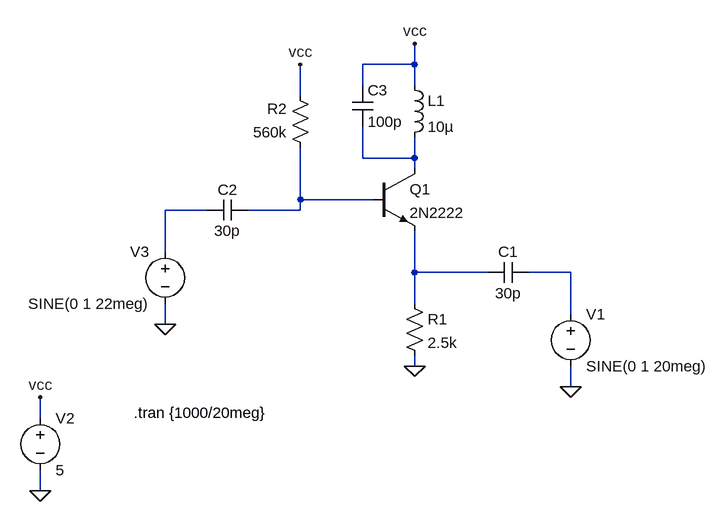
[diagram p0: schematic mixer_bjt.asc]
mixer_bjt.asc, the LTspice schematic file:
Version 4
SHEET 1 880 680
WIRE 160 -16 160 -48
WIRE 160 -16 80 -16
WIRE 80 16 80 -16
WIRE 160 16 160 -16
WIRE -16 32 -16 -16
WIRE 80 128 80 80
WIRE 160 128 160 96
WIRE 160 128 80 128
WIRE 160 144 160 128
WIRE -16 192 -16 112
WIRE 96 192 -16 192
WIRE -160 208 -224 208
WIRE -16 208 -16 192
WIRE -16 208 -96 208
WIRE -224 272 -224 208
WIRE 160 304 160 240
WIRE 272 304 160 304
WIRE 400 304 336 304
WIRE 160 352 160 304
WIRE 400 368 400 304
WIRE -224 384 -224 352
WIRE 160 448 160 432
WIRE 400 480 400 448
WIRE -416 528 -416 496
WIRE -416 640 -416 608
FLAG 160 448 0
FLAG 400 480 0
FLAG -416 640 0
FLAG -416 496 vcc
FLAG 160 -48 vcc
FLAG -224 384 0
FLAG -16 -16 vcc
SYMBOL res 144 336 R0
SYMATTR InstName R1
SYMATTR Value 2.5k
SYMBOL cap 336 288 R90
WINDOW 0 0 32 VBottom 2
WINDOW 3 32 32 VTop 2
SYMATTR InstName C1
SYMATTR Value 30p
SYMBOL voltage 400 352 R0
WINDOW 123 0 0 Left 0
WINDOW 39 0 0 Left 0
SYMATTR InstName V1
SYMATTR Value SINE(0 1 20meg)
SYMBOL voltage -416 512 R0
WINDOW 123 0 0 Left 0
WINDOW 39 0 0 Left 0
SYMATTR InstName V2
SYMATTR Value 5
SYMBOL res 0 128 R180
WINDOW 0 36 76 Left 2
WINDOW 3 36 40 Left 2
SYMATTR InstName R2
SYMATTR Value 560k
SYMBOL ind 144 0 R0
SYMATTR InstName L1
SYMATTR Value 10µ
SYMBOL cap -160 192 M90
WINDOW 0 0 32 VBottom 2
WINDOW 3 32 32 VTop 2
SYMATTR InstName C2
SYMATTR Value 30p
SYMBOL voltage -224 256 M0
WINDOW 123 0 0 Left 0
WINDOW 39 0 0 Left 0
SYMATTR InstName V3
SYMATTR Value SINE(0 1 22meg)
SYMBOL cap 64 16 R0
SYMATTR InstName C3
SYMATTR Value 100p
SYMBOL npn 96 144 R0
SYMATTR InstName Q1
SYMATTR Value 2N2222
TEXT -272 520 Left 2 !.tran {1000/20meg}

The netlist it stands for:
* mixer_bjt.asc
R1 N004 0 2.5k
C1 N005 N004 30p
V1 N005 0 SINE(0 1 20meg)
V2 vcc 0 5
R2 N002 vcc 560k
L1 vcc N001 10µ
C2 N003 N002 30p
V3 N003 0 SINE(0 1 22meg)
C3 vcc N001 100p
Q1 N001 N002 N004 0 2N2222
.model NPN NPN
.model PNP PNP
.lib standard.bjt
.tran {1000/20meg}
.backanno
.end